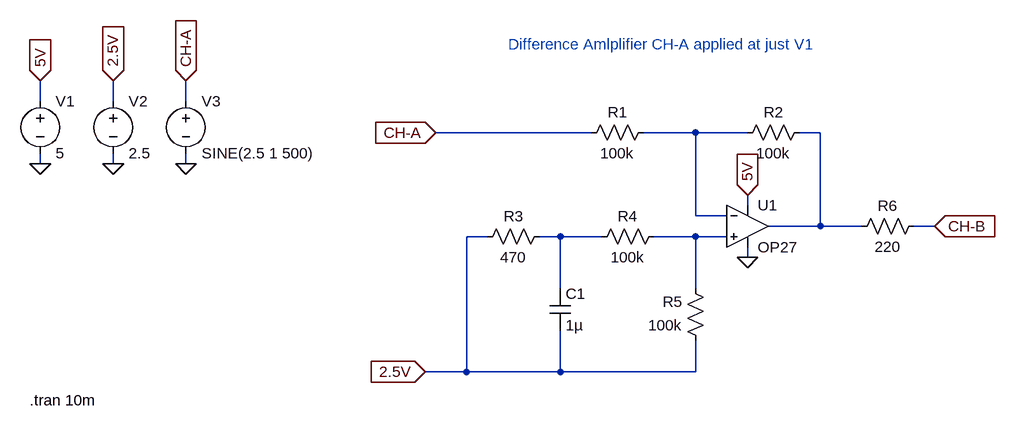
[diagram p0: schematic difference_amp_cha_v1_ltspice.asc]
difference_amp_cha_v1_ltspice.asc, the LTspice schematic file:
Version 4
SHEET 1 880 680
WIRE -960 -16 -960 -48
WIRE -848 -16 -848 -48
WIRE -736 -16 -736 -48
WIRE -112 32 -352 32
WIRE 48 32 -32 32
WIRE 128 32 48 32
WIRE 240 32 208 32
WIRE -960 80 -960 64
WIRE -848 80 -848 64
WIRE -736 80 -736 64
WIRE 128 144 128 128
WIRE 48 160 48 32
WIRE 96 160 48 160
WIRE 240 176 240 32
WIRE 240 176 160 176
WIRE 304 176 240 176
WIRE 416 176 384 176
WIRE -272 192 -304 192
WIRE -160 192 -192 192
WIRE -96 192 -160 192
WIRE 48 192 -16 192
WIRE 96 192 48 192
WIRE 128 224 128 208
WIRE -160 272 -160 192
WIRE 48 272 48 192
WIRE -304 400 -304 192
WIRE -304 400 -368 400
WIRE -160 400 -160 336
WIRE -160 400 -304 400
WIRE 48 400 48 352
WIRE 48 400 -160 400
FLAG 128 128 5V
IOPIN 128 128 In
FLAG 128 224 0
FLAG 416 176 CH-B
IOPIN 416 176 In
FLAG -368 400 2.5V
IOPIN -368 400 In
FLAG -960 80 0
FLAG -848 80 0
FLAG -736 80 0
FLAG -960 -48 5V
IOPIN -960 -48 In
FLAG -848 -48 2.5V
IOPIN -848 -48 In
FLAG -736 -48 CH-A
IOPIN -736 -48 In
FLAG -352 32 CH-A
IOPIN -352 32 In
SYMBOL res -16 16 R90
WINDOW 0 0 56 VBottom 2
WINDOW 3 32 56 VTop 2
SYMATTR InstName R1
SYMATTR Value 100k
SYMBOL res 224 16 R90
WINDOW 0 0 56 VBottom 2
WINDOW 3 32 56 VTop 2
SYMATTR InstName R2
SYMATTR Value 100k
SYMBOL res -176 176 R90
WINDOW 0 0 56 VBottom 2
WINDOW 3 32 56 VTop 2
SYMATTR InstName R3
SYMATTR Value 470
SYMBOL res 0 176 R90
WINDOW 0 0 56 VBottom 2
WINDOW 3 32 56 VTop 2
SYMATTR InstName R4
SYMATTR Value 100k
SYMBOL res 64 368 R180
WINDOW 0 36 76 Left 2
WINDOW 3 36 40 Left 2
SYMATTR InstName R5
SYMATTR Value 100k
SYMBOL res 288 192 R270
WINDOW 0 32 56 VTop 2
WINDOW 3 0 56 VBottom 2
SYMATTR InstName R6
SYMATTR Value 220
SYMBOL cap -176 272 R0
SYMATTR InstName C1
SYMATTR Value 1µ
SYMBOL voltage -960 -32 R0
SYMATTR InstName V1
SYMATTR Value 5
SYMBOL voltage -848 -32 R0
SYMATTR InstName V2
SYMATTR Value 2.5
SYMBOL voltage -736 -32 R0
WINDOW 123 0 0 Left 0
WINDOW 39 0 0 Left 0
SYMATTR InstName V3
SYMATTR Value SINE(2.5 1 500)
SYMBOL Opamps\\OP27 128 112 R0
SYMATTR InstName U1
TEXT -240 -104 Left 2 ;Difference Amlplifier CH-A applied at just V1
TEXT -976 444 Left 2 !.tran 10m

The netlist it stands for:
* difference_amp_cha_v1_ltspice.asc
R1 N001 CH-A 100k
R2 N002 N001 100k
R3 N003 2.5V 470
R4 N004 N003 100k
R5 2.5V N004 100k
R6 N002 CH-B 220
C1 N003 2.5V 1µ
V1 5V 0 5
V2 2.5V 0 2.5
V3 CH-A 0 SINE(2.5 1 500)
XU1 N004 N001 5V 0 N002 OP27  ; pins In+ In- V+ V- OUT
* Difference Amlplifier CH-A applied at just V1
.tran 10m
.lib ADI.lib
.backanno
.end